# Altium schematic sheet Sheet_Amp_1.SchDoc
size A4
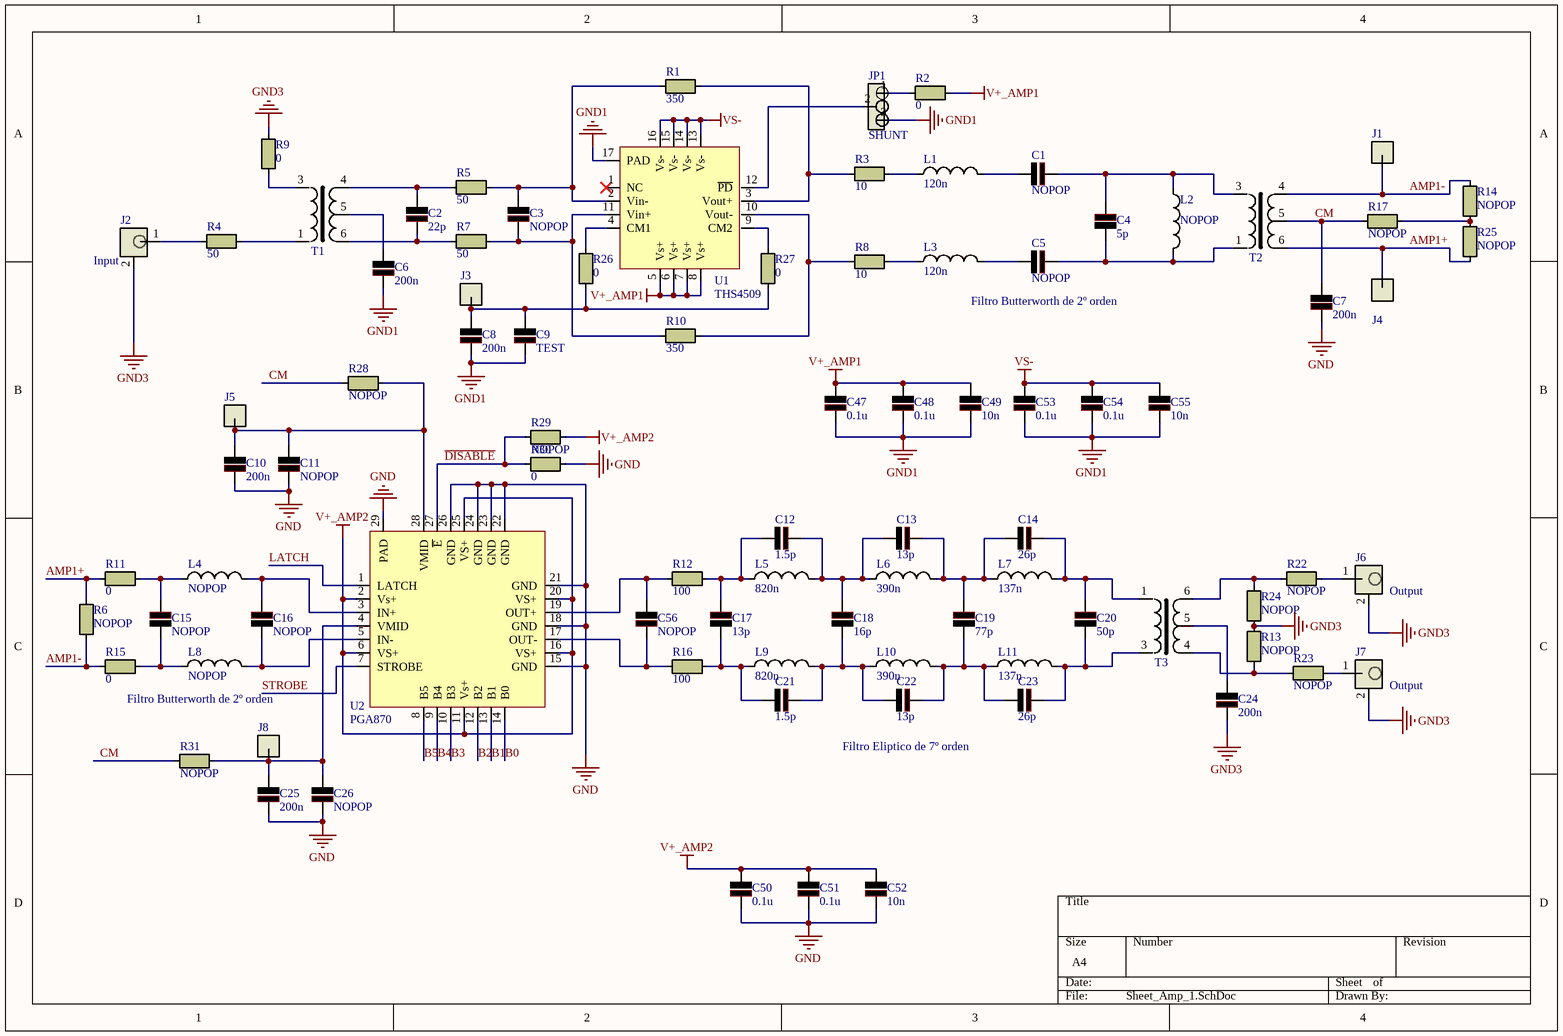
[diagram p0: Sheet_Amp_1.SchDoc]

## Parts
C1  NOPOP  [C_0603]
C2  22p  [C_0603]
C3  NOPOP  [C_0603]
C4  5p  [C_0603]
C5  NOPOP  [C_0603]
C6  200n  [C_0603]
C7  200n  [C_0603]
C8  200n  [C_0805]
C9  TEST  [C_0805]
C10  200n  [C_0805]
C11  NOPOP  [C_0805]
C12  1.5p  [C_0603]
C13  13p  [C_0603]
C14  26p  [C_0603]
C15  NOPOP  [C_0603]
C16  NOPOP  [C_0603]
C17  13p  [C_0603]
C18  16p  [C_0603]
C19  77p  [C_0603]
C20  50p  [C_0603]
C21  1.5p  [C_0603]
C22  13p  [C_0603]
C23  26p  [C_0603]
C24  200n  [C_0603]
C25  200n  [C_0805]
C26  NOPOP  [C_0805]
C47  0.1u  [C_0805]
C48  0.1u  [C_0805]
C49  10n  [C_0805]
C50  0.1u  [C_0805]
C51  0.1u  [C_0805]
C52  10n  [C_0805]
C53  0.1u  [C_0805]
C54  0.1u  [C_0805]
C55  10n  [C_0805]
C56  NOPOP  [C_0603]
J1  TEST POINT  [TEST_Point]  (value not drawn)
J2  Input  [BNC]
J3  TEST POINT  [TEST_Point]  (value not drawn)
J4  TEST POINT  [TEST_Point]  (value not drawn)
J5  TEST POINT  [TEST_Point]  (value not drawn)
J6  Output  [SMA]
J7  Output  [SMA]
J8  TEST POINT  [TEST_Point]  (value not drawn)
JP1  SHUNT  [JUMPER_2,54_3]
L1  120n  [L_0603]
L2  NOPOP  [L_0603]
L3  120n  [L_0603]
L4  NOPOP  [L_0603]
L5  820n  [L_0603]
L6  390n  [L_0603]
L7  137n  [L_0603]
L8  NOPOP  [L_0603]
L9  820n  [L_0603]
L10  390n  [L_0603]
L11  137n  [L_0603]
R1  350  [R_0603]
R2  0  [R_0603]
R3  10  [R_0603]
R4  50  [R_0603]
R5  50  [R_0603]
R6  NOPOP  [R_0603]
R7  50  [R_0603]
R8  10  [R_0603]
R9  0  [R_0603]
R10  350  [R_0603]
R11  0  [R_0603]
R12  100  [R_0603]
R13  NOPOP  [R_0603]
R14  NOPOP  [R_0603]
R15  0  [R_0603]
R16  100  [R_0603]
R17  NOPOP  [R_0603]
R22  NOPOP  [R_0603]
R23  NOPOP  [R_0603]
R24  NOPOP  [R_0603]
R25  NOPOP  [R_0603]
R26  0  [R_0603]
R27  0  [R_0603]
R28  NOPOP  [R_0603]
R29  NOPOP  [R_0603]
R30  0  [R_0603]
R31  NOPOP  [R_0603]
T1  ADT1-1WT  [TRASFORMADOR_2.54]  (value not drawn)
T2  ADT1-1WT  [TRASFORMADOR_2.54]  (value not drawn)
T3  ADT1-1WT  [TRASFORMADOR_2.54]  (value not drawn)
U1  THS4509  [QFN_16]
U2  PGA870  [QFN_28]

## Nets
GND: C7.2 C10.2 C11.2 C25.2 C26.2 C50.2 C51.2 C52.2 R30.2 U2.15(GND) U2.18(GND) U2.21(GND) U2.22(GND) U2.23(GND) U2.24(GND) U2.26(GND) U2.29(PAD)
GND1: C6.2 C8.2 C9.2 C47.2 C48.2 C49.2 C53.2 C54.2 C55.2 JP1.3 U1.17(PAD)
GND3: C24.2 J2.2 J6.2 J7.2 R9.2 R13.2 R24.1
V+_AMP1: C47.1 C48.1 C49.1 R2.2 U1.5(Vs+) U1.6(Vs+) U1.7(Vs+) U1.8(Vs+)
V+_AMP2: C50.1 C51.1 C52.1 R29.2 U2.2(Vs+) U2.6(VS+) U2.11(Vs+) U2.16(VS+) U2.20(VS+) U2.25(VS+)
VS-: C53.1 C54.1 C55.1 U1.13(Vs-) U1.14(Vs-) U1.15(Vs-) U1.16(Vs-)
AMP1+: J4.1 R6.2 R11.1 R25.1 T2.6
AMP1-: J1.1 R6.1 R14.2 R15.1 T2.4
B0: U2.14(B0)
B1: U2.13(B1)
B2: U2.12(B2)
B3: U2.10(B3)
B4: U2.9(B4)
B5: U2.8(B5)
CM: C7.1 R17.2 R28.1 R31.1 T2.5
~{DISABLE}: R29.1 R30.1 U2.27(~{E})
LATCH: U2.1(LATCH)
STROBE: U2.7(STROBE)
NetC1_1: C1.1 L1.2
NetC1_2: C1.2 C4.2 L2.1 T2.3
NetC2_1: C2.1 R5.1 T1.4
NetC2_2: C2.2 R7.1 T1.6
NetC3_1: C3.1 R1.1 R5.2 U1.2(Vin-)
NetC3_2: C3.2 R7.2 R10.1 U1.11(Vin+)
NetC4_1: C4.1 C5.2 L2.2 T2.1
NetC5_1: C5.1 L3.2
NetC6_1: C6.1 T1.5
NetC8_1: C8.1 C9.1 J3.1 R26.1 R27.1
NetC10_1: C10.1 C11.1 J5.1 R28.2 U2.28(VMID)
NetC12_1: C12.1 C17.2 L5.1 R12.2
NetC12_2: C12.2 C13.1 C18.2 L5.2 L6.1
NetC13_2: C13.2 C14.1 C19.2 L6.2 L7.1
NetC14_2: C14.2 C20.2 L7.2 T3.1
NetC15_1: C15.1 L8.1 R15.2
NetC15_2: C15.2 L4.1 R11.2
NetC16_1: C16.1 L8.2 U2.5(IN-)
NetC16_2: C16.2 L4.2 U2.3(IN+)
NetC17_1: C17.1 C21.1 L9.1 R16.2
NetC18_1: C18.1 C21.2 C22.1 L9.2 L10.1
NetC19_1: C19.1 C22.2 C23.1 L10.2 L11.1
NetC20_1: C20.1 C23.2 L11.2 T3.3
NetC24_1: C24.1 T3.5
NetC25_1: C25.1 C26.1 J8.1 R31.2 U2.4(VMID)
NetC56_1: C56.1 R12.1 U2.19(OUT+)
NetC56_2: C56.2 R16.1 U2.17(OUT-)
NetJ2_1: J2.1 R4.1
NetJ6_1: J6.1 R22.2
NetJ7_1: J7.1 R23.2
NetJP1_1: JP1.1 R2.1
NetJP1_2: JP1.2 U1.12(~{PD})
NetL1_1: L1.1 R3.2
NetL3_1: L3.1 R8.2
NetR1_2: R1.2 R3.1 U1.3(Vout+)
NetR4_2: R4.2 T1.1
NetR8_1: R8.1 R10.2 U1.10(Vout-)
NetR9_1: R9.1 T1.3
NetR13_1: R13.1 R23.1 T3.4
NetR14_1: R14.1 R17.1 R25.2
NetR22_1: R22.1 R24.2 T3.6
NetR26_2: R26.2 U1.4(CM1)
NetR27_2: R27.2 U1.9(CM2)

Not connected (* = marked no-connect by the designer): U1 1(NC)*

## Notes on the sheet
- Filtro Butterworth de 2º orden
- Filtro Eliptico de 7º orden

## Library data of the parts
C1-C26 C47-C56 = C: Precio: 0,553; Código Mouser: 647-UCL1E331MNL1GS
L1-L11 = L: Precio: 0,59; Código Mouser: 652-SDR1005-331KL
R1-R17 R22-R31 = R: Precio: 0,05; Código Mouser: Variable
T1-T3 = Transformer_center_tab